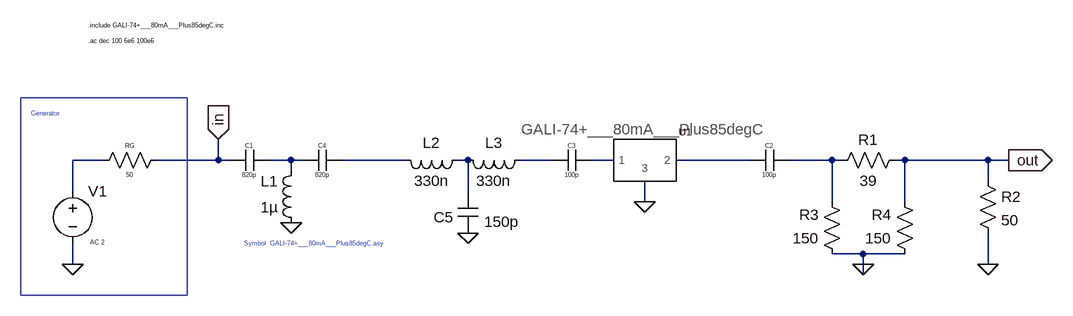
[diagram p0: schematic GALI-74_Test_Circuit-v3.asc]
GALI-74_Test_Circuit-v3.asc, the LTspice schematic file:
Version 4
SHEET 1 1328 680
WIRE -160 128 -208 128
WIRE 16 128 16 96
WIRE 16 128 -80 128
WIRE 32 128 16 128
WIRE 128 128 96 128
WIRE 144 128 128 128
WIRE 304 128 208 128
WIRE 400 128 384 128
WIRE 528 128 480 128
WIRE 624 128 592 128
WIRE 832 128 720 128
WIRE 960 128 896 128
WIRE 976 128 960 128
WIRE 1072 128 1056 128
WIRE 1200 128 1072 128
WIRE 1232 128 1200 128
WIRE 128 144 128 128
WIRE 1200 160 1200 128
WIRE -208 176 -208 128
WIRE 400 176 400 128
WIRE 672 192 672 160
WIRE 960 192 960 128
WIRE 1072 192 1072 128
WIRE 1008 272 960 272
WIRE 1072 272 1008 272
WIRE -208 288 -208 256
WIRE 1008 288 1008 272
WIRE 1200 288 1200 240
WIRE 1008 304 1008 288
FLAG 1200 288 0
FLAG -208 288 0
FLAG 672 192 0
FLAG 1232 128 out
IOPIN 1232 128 Out
FLAG 16 96 in
IOPIN 16 96 In
FLAG 128 224 0
FLAG 400 240 0
FLAG 1008 288 0
SYMBOL voltage -208 160 R0
WINDOW 123 27 94 Left 0
WINDOW 39 0 0 Left 0
SYMATTR Value2 AC 2
SYMATTR InstName V1
SYMATTR Value ""
SYMBOL res -176 144 R270
WINDOW 0 32 56 VTop 0
WINDOW 3 0 56 VBottom 0
SYMATTR InstName RG
SYMATTR Value 50
SYMBOL res 1184 144 R0
SYMATTR InstName R2
SYMATTR Value 50
SYMBOL cap 832 144 R270
WINDOW 0 32 32 VTop 0
WINDOW 3 0 32 VBottom 0
SYMATTR InstName C2
SYMATTR Value 100p
SYMBOL cap 32 144 R270
WINDOW 0 32 32 VTop 0
WINDOW 3 0 32 VBottom 0
SYMATTR InstName C1
SYMATTR Value 820p
SYMBOL GALI-74+___80mA___Plus85degC 672 128 R0
SYMATTR Value GALI-74+___80mA___Plus85degC
SYMATTR InstName U1
SYMBOL ind 144 240 R180
WINDOW 0 36 80 Left 2
WINDOW 3 36 40 Left 2
SYMATTR InstName L1
SYMATTR Value 1µ
SYMBOL cap 144 144 R270
WINDOW 0 32 32 VTop 0
WINDOW 3 0 32 VBottom 0
SYMATTR InstName C4
SYMATTR Value 820p
SYMBOL cap 528 144 R270
WINDOW 0 32 32 VTop 0
WINDOW 3 0 32 VBottom 0
SYMATTR InstName C3
SYMATTR Value 100p
SYMBOL ind 400 112 R90
WINDOW 0 5 56 VBottom 2
WINDOW 3 32 56 VTop 2
SYMATTR InstName L2
SYMATTR Value 330n
SYMBOL ind 496 112 R90
WINDOW 0 5 56 VBottom 2
WINDOW 3 32 56 VTop 2
SYMATTR InstName L3
SYMATTR Value 330n
SYMBOL cap 384 176 R0
WINDOW 0 -37 40 Left 2
WINDOW 3 41 47 Left 2
SYMATTR InstName C5
SYMATTR Value 150p
SYMBOL res 1072 112 R90
WINDOW 0 0 56 VBottom 2
WINDOW 3 32 56 VTop 2
SYMATTR InstName R1
SYMATTR Value 39
SYMBOL res 976 288 R180
WINDOW 0 36 76 Left 2
WINDOW 3 36 40 Left 2
SYMATTR InstName R3
SYMATTR Value 150
SYMBOL res 1088 288 R180
WINDOW 0 36 76 Left 2
WINDOW 3 36 40 Left 2
SYMATTR InstName R4
SYMATTR Value 150
TEXT -184 -56 Left 0 !.ac dec 100 6e6 100e6
TEXT -272 56 Left 0 ;Generator
TEXT 56 256 Left 0 ;Symbol  GALI-74+___80mA___Plus85degC.asy
TEXT -184 -80 Left 0 !.include GALI-74+___80mA___Plus85degC.inc
RECTANGLE Normal -32 336 -288 32

The netlist it stands for:
* GALI-74_Test_Circuit-v3.asc
V1 N001 0 AC 2
RG N001 in 50
R2 out 0 50
C2 N007 N008 100p
C1 in N002 820p
XU1 N006 N007 0 GALI-74+___80mA___Plus85degC GALI-74+___80mA___Plus85degC  ; pins 1 2 3
L1 0 N002 1µ
C4 N002 N003 820p
C3 N005 N006 100p
L2 N004 N003 330n
L3 N005 N004 330n
C5 N004 0 150p
R1 out N008 39
R3 0 N008 150
R4 0 out 150
.ac dec 100 6e6 100e6
* Generator
* Symbol  GALI-74+___80mA___Plus85degC.asy
.include GALI-74+___80mA___Plus85degC.inc
.lib GALI-74+___80mA___Plus85degC.inc
.backanno
.end